# Altium schematic sheet 博亿精科WRX-40N手抄-20260610.SchDoc
size A2
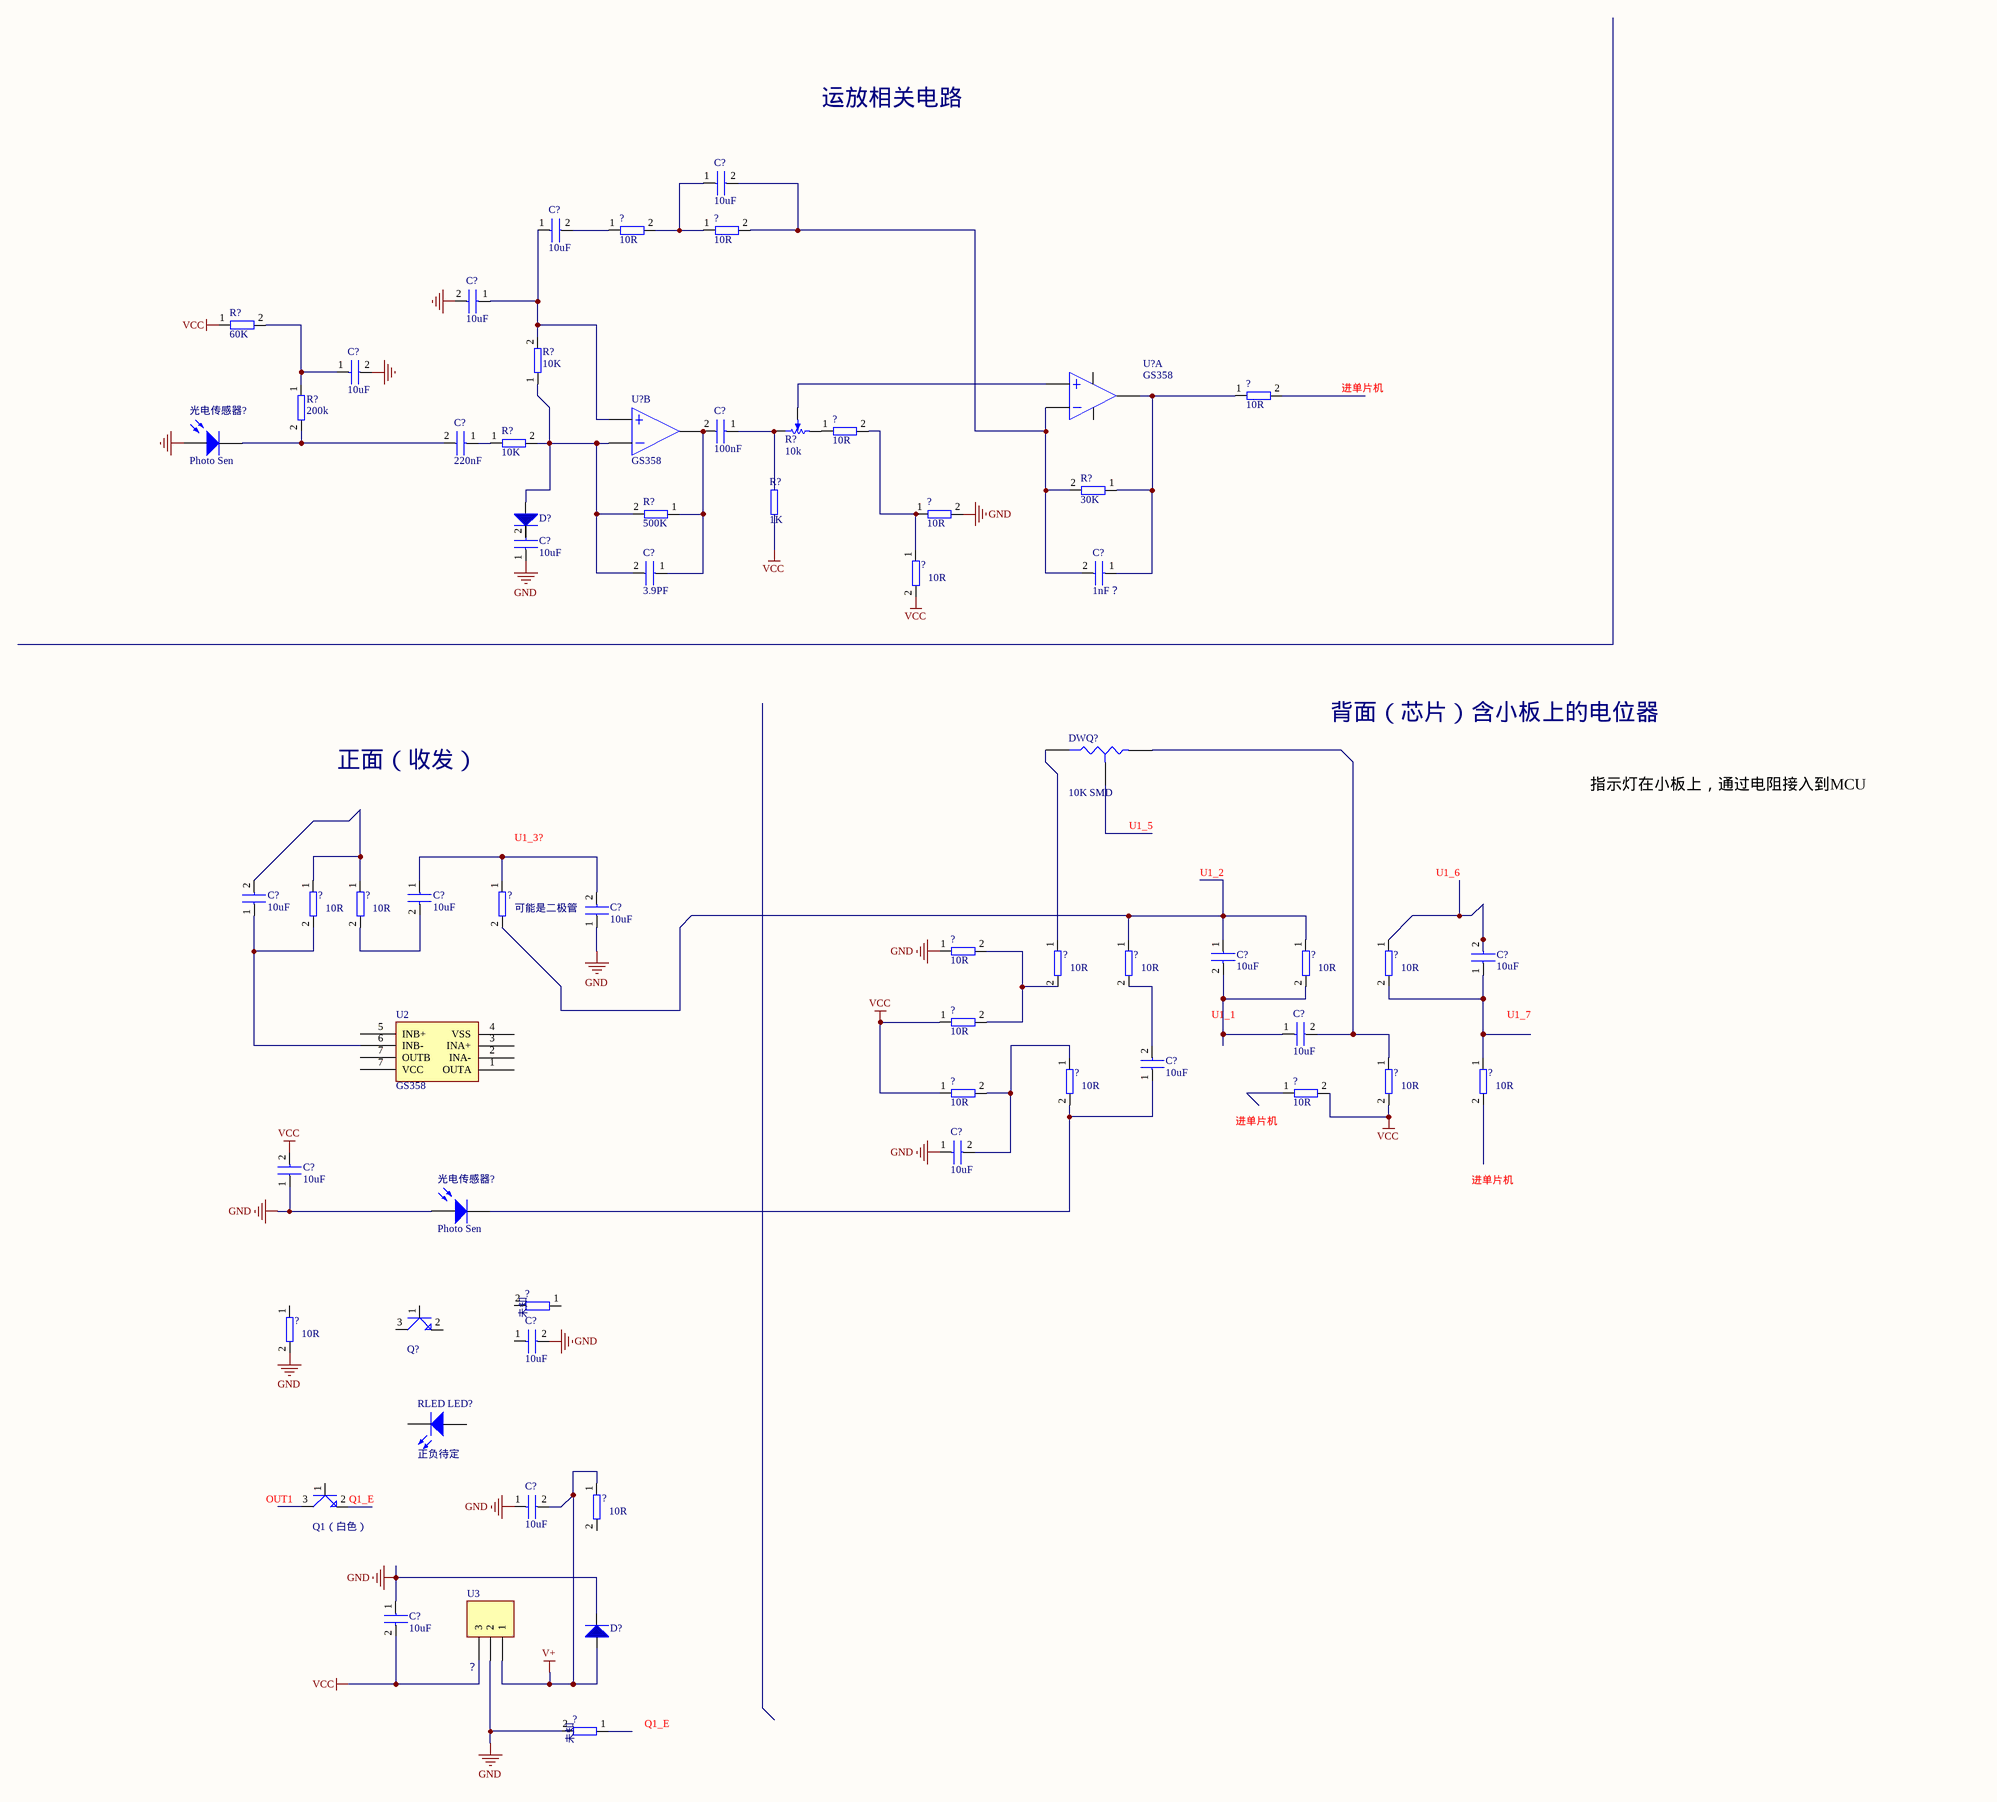
[diagram p0: 博亿精科WRX-40N手抄-20260610.SchDoc]

## Parts
(Parts that share a designator on the sheet are numbered #1, #2 ... from top to bottom, then left to right.)
?#1  10R
?#2  10R
?#3  10R
?#4  10R
?#5  10R
?#6  10R
?#7  10R
?#8  10R
?#9  可能是二极管
?#10  10R
?#11  10R
?#12  10R
?#13  10R
?#14  10R
?#15  10R
?#16  10R
?#17  10R
?#18  10R
?#19  10R
?#20  10R
?#21  10R
?#22  未知
?#23  10R
?#24  未知
C?#1  10uF
C?#2  10uF
C?#3  10uF
C?#4  10uF
C?#5  100nF
C?#6  220nF
C?#7  10uF
C?#8  3.9PF
C?#9  1nF？
C?#10  10uF
C?#11  10uF
C?#12  10uF
C?#13  10uF
C?#14  10uF
C?#15  10uF
C?#16  10uF
C?#17  10uF
C?#18  10uF
C?#19  10uF
C?#20  10uF
C?#21  10uF
D?#1  (no value)
D?#2  (no value)
DWQ?  value 10K SMD  [VR3]  (hidden comment: Res Tap)
Q1（白色）  2SC4617TLR  (value not drawn)
Q?  2SC4617TLR  (value not drawn)
R?#1  60K
R?#2  200k
R?#3  10K
R?#4  10k  [POT4MM-2]
R?#5  10K
R?#6  1K
R?#7  30K
R?#8  500K
RLED_LED?  正负待定  [LED-0]
U2  GS358
U3  ？  [HDR1X3]
U?#1  GS358  [SOP-8]  (part A of 2)
U?#2  GS358  [SOP-8]  (part B of 2)
光电传感器?#1  Photo Sen  [PIN2]
光电传感器?#2  Photo Sen  [PIN2]

## Nets
GND: ?#5.2 ?#14.1 ?#21.2 ?#24.2 C?#3.2 C?#4.2 C?#7.1 C?#12.1 C?#17.1 C?#18.1 C?#19.2 C?#20.1 C?#21.1 D?#2.2 U3.2 光电传感器?#1.1(A) 光电传感器?#2.1(A)
V+: ?#23.1 C?#20.2 D?#2.1 U3.1
VCC: ?#6.2 ?#15.1 ?#17.2 ?#19.1 ?#20.2 C?#18.2 C?#21.2 R?#1.1 U3.3
Net?#1_1: ?#1.1 C?#2.2
Net?#1_2: ?#1.2 ?#2.1 C?#1.1
Net?#2_2: ?#2.2 C?#1.2 C?#9.2 R?#7.2 U?#1.2
Net?#3_1: ?#3.1 C?#9.1 R?#7.1 U?#1.1
Net?#4_1: ?#4.1 R?#4.CCW(-)
Net?#4_2: ?#4.2 ?#5.1 ?#6.1
Net?#7_1: ?#7.1 ?#8.1 C?#11.2
Net?#7_2: ?#7.2 C?#11.1 U2.6(INB-)
Net?#8_2: ?#8.2 C?#10.2
Net?#9_1: ?#9.1 C?#10.1 C?#12.2
Net?#9_2: ?#9.2 ?#11.1 ?#12.1 C?#13.1
Net?#10_1: ?#10.1 DWQ?.2(B)
Net?#10_2: ?#10.2 ?#14.2 ?#15.2
Net?#11_2: ?#11.2 C?#16.2
Net?#12_2: ?#12.2 C?#13.2 C?#15.1
Net?#13_1: ?#13.1 C?#14.2
Net?#13_2: ?#13.2 ?#18.1 C?#14.1
Net?#16_1: ?#16.1 ?#19.2 C?#17.2
Net?#16_2: ?#16.2 C?#16.1 光电传感器?#2.2(K)
Net?#17_1: ?#17.1 C?#15.2 DWQ?.1(A)
NetC?#2_1: C?#2.1 C?#3.1 R?#3.2 U?#2.5
NetC?#4_1: C?#4.1 R?#1.2 R?#2.1
NetC?#5_1: C?#5.1 R?#4.CW(+)
NetC?#5_2: C?#5.2 C?#8.1 R?#8.1 U?#2.7
NetC?#6_1: C?#6.1 R?#5.1
NetC?#6_2: C?#6.2 R?#2.2 光电传感器?#1.2(K)
NetC?#8_2: C?#8.2 D?#1.1 R?#3.1 R?#5.2 R?#8.2 U?#2.6
NetR?#4_W: R?#4.W U?#1.3

Not connected (* = marked no-connect by the designer): ?#3 2; ?#18 2; ?#20 1; ?#21 1; ?#22 1 2; ?#23 2; ?#24 1; C?#7 2; C?#19 1; D?#1 2; DWQ? 3(TAP); Q1（白色） 1(B) 2(E) 3(C); Q? 1(B) 2(E) 3(C); R?#6 1 2; RLED_LED? 1(A) 2(K); U2 1(OUTA) 2(INA-) 3(INA+) 4(VSS) 5(INB+) 7(OUTB); U?#1 4 8

## Notes on the sheet
- 运放相关电路
- 进单片机
- 背面（芯片）含小板上的电位器
- 正面（收发）
- U1_3?
- U1_5
- U1_2
- U1_6
- 指示灯在小板上，通过电阻接入到MCU
- U1_1
- U1_7
- (near ?#20) 进单片机
- (near Q1（白色）) OUT1
- (near Q1（白色）) Q1_E
- Q1_E

## Library data of the parts
?#1-?#24 R?#1-R?#3 R?#5-R?#8 = RES
C?#1-C?#21 = CAP
D?#1 D?#2 = D
DWQ? = Res Tap: Tapped Resistor; Sim Note: Enter the Resistance value and the set point into parameter fields.; Set Position: 0.5; Published: 24-Mar-1999; LatestRevisionDate: 17-Jul-2002; LatestRevisionNote: Re-released for DXP Platform.; PackageReference: VR3; Publisher: Altium Limited; PackageDescription: Variable Resistor, Thru-Hole; 3 Leads
Q1（白色） Q? = 2SC4617
R?#4 = RPot SM: Square Trimming Potentiometer; Published: 17-Dec-2003; DatasheetVersion: Oct-2003; PackageReference: POT4MM-2; Publisher: Altium Limited; PackageDescription: Square Trimming Potentiometer; ComponentLink1Description: Manufacturer Link; ComponentLink1URL: http://bourns.com/2/search.html
RLED_LED? = LED0: Typical INFRARED GaAs LED; Published: 8-Jun-2000; LatestRevisionDate: 08-Jul-2005; LatestRevisionNote: Mech Layer 1 removed.; PackageReference: LED-0; Publisher: Altium Limited; PackageDescription: LED; 2 Leads
U3 = Header 3: Header, 3-Pin; LatestRevisionDate: 17-Jul-2002; LatestRevisionNote: Re-released for DXP Platform.; Publisher: Altium Limited
U?#1 U?#2 = LM358
光电传感器?#1 光电传感器?#2 = Photo Sen: Photosensitive Diode; Published: 24-Mar-1999; LatestRevisionDate: 17-Jul-2002; LatestRevisionNote: Re-released for DXP Platform.; PackageReference: PIN2; Publisher: Altium Limited